# Altium schematic sheet secondary_DIO.SchDoc: foxBMS BMS-Slave 12-Cell
size A3; DocumentNumber: 19; SheetNumber: 19; SheetTotal: 21; AUTHOR: Fraunhofer IISB foxBMS Team; SheetDescription: Secondary Digital Inputs/Outputs
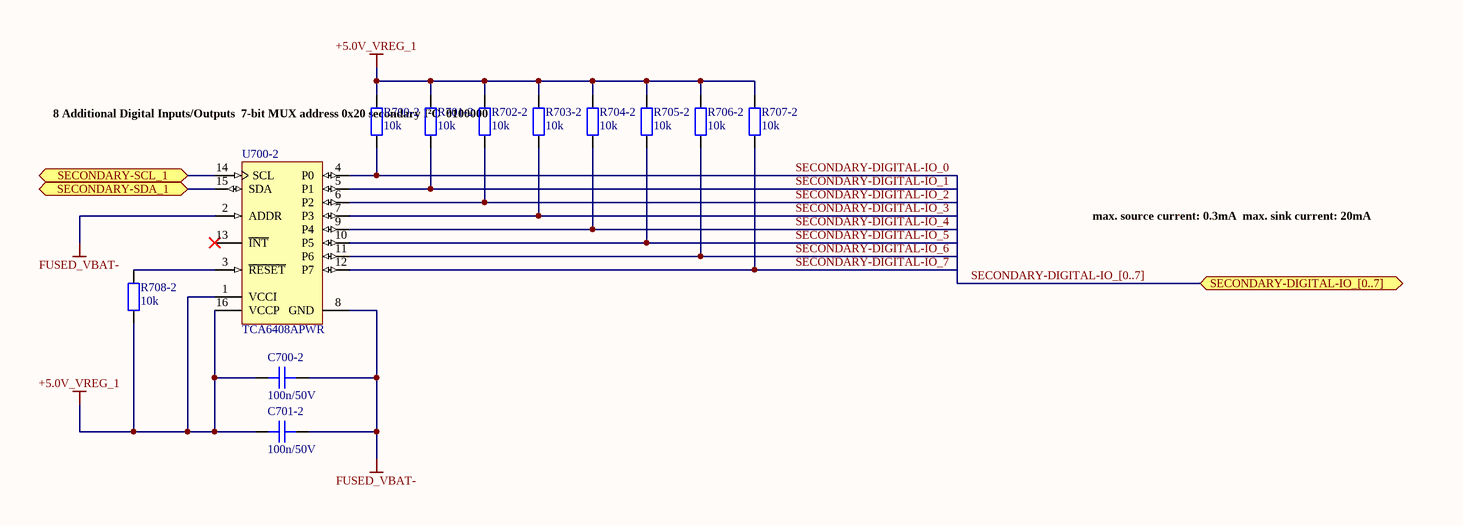
[diagram p0: secondary_DIO.SchDoc]

## Parts
C700-2  100n/50V  [CAPC1608X08N]
C701-2  100n/50V  [CAPC1608X08N]
R700-2  10k  [RESC1608X05N]
R701-2  10k  [RESC1608X05N]
R702-2  10k  [RESC1608X05N]
R703-2  10k  [RESC1608X05N]
R704-2  10k  [RESC1608X05N]
R705-2  10k  [RESC1608X05N]
R706-2  10k  [RESC1608X05N]
R707-2  10k  [RESC1608X05N]
R708-2  10k  [RESC1608X05N]
U700-2  TCA6408APWR  [PW0016A_L]

## Ports
SECONDARY-DIGITAL-IO_[0..7] (bidir), SECONDARY-SCL_1 (bidir), SECONDARY-SDA_1 (bidir)

## Nets
+5.0V_VREG_1: C700-2.2 C701-2.2 R700-2.2 R701-2.2 R702-2.2 R703-2.2 R704-2.2 R705-2.2 R706-2.2 R707-2.2 R708-2.1 U700-2.1(VCCI) U700-2.16(VCCP)
FUSED_VBAT-: C700-2.1 C701-2.1 U700-2.2(ADDR) U700-2.8(GND)
SECONDARY-DIGITAL-IO_0: R700-2.1 U700-2.4(P0)
SECONDARY-DIGITAL-IO_1: R701-2.1 U700-2.5(P1)
SECONDARY-DIGITAL-IO_2: R702-2.1 U700-2.6(P2)
SECONDARY-DIGITAL-IO_3: R703-2.1 U700-2.7(P3)
SECONDARY-DIGITAL-IO_4: R704-2.1 U700-2.9(P4)
SECONDARY-DIGITAL-IO_5: R705-2.1 U700-2.10(P5)
SECONDARY-DIGITAL-IO_6: R706-2.1 U700-2.11(P6)
SECONDARY-DIGITAL-IO_7: R707-2.1 U700-2.12(P7)
SECONDARY-SCL_1: U700-2.14(SCL) ; port SECONDARY-SCL_1
SECONDARY-SDA_1: U700-2.15(SDA) ; port SECONDARY-SDA_1
NetR708-2_2: R708-2.2 U700-2.3(~{RESET})

Not connected (* = marked no-connect by the designer): U700-2 13(~{INT})*

## Buses and harness runs
bus SECONDARY-DIGITAL-IO_[0..7] = port SECONDARY-DIGITAL-IO_[0..7]

## Notes on the sheet
- 8 Additional Digital Inputs/Outputs
  7-bit MUX address 0x20 secondary I²C
  0100000
- max. source current: 0.3mA
  max. sink current: 20mA
- Fraunhofer IISB
- Schottkystr. 10
- developed by:
- 91058 Erlangen
- Germany
- Author
- Project
- License
- Description
- File
- Version
- Release Date
- Sheet
- www.foxbms.org
- www.iisb.fraunhofer.de
- foxBMS Team
- /

## Library data of the parts
C700-2 C701-2 = gen_C_ceramic_100n_50V_X7R_0603: MLCC; Capacitance: 100n; Rated Voltage: 50V; Dielectric: X7R; Case EIA: 0603; Case Metric: 1608; PnP Package: C_0603_10; PnP Value: 100n/50V/X7R; PnP equipped: x; Automotive Qualified: True; Part Number: gen_C_ceramic_100n_50V_X7R_0603; Supplier 1: Farnell; Supplier Part Number 1: 2525267; Supplier 2: Digikey; Supplier Part Number 2: 490-6049-1-ND; Supplier 3: Farnell; Supplier Part Number 3: 2070398
R700-2 R701-2 R702-2 R703-2 R704-2 R705-2 R706-2 R707-2 = gen_R_10k_0603: SMD Resistor 10k 0603; Tolerance: 1%; Power: 0.1W; Case EIA: 0603; Case Metric: 1608; Maximum Working Voltage: 75V; PnP Package: R_0603; Automotive Qualified: False; Part Number: gen_R_10k_0603; Operating Temperature: -55°C - +155°C; Resistance: 10k; Series: E24, E96; PnP Value: 10k; Supplier 1: Farnell; Supplier Part Number 1: 2073349
R708-2 = gen_R_10k_0603: SMD Resistor 10k 0603; Tolerance: 1%; Power: 0.1W; Case EIA: 0603; Case Metric: 1608; Maximum Working Voltage: 75V; PnP Package: R_0603; Automotive Qualified: True; Part Number: gen_R_10k_0603; Operating Temperature: -55°C - +155°C; Resistance: 10k; Series: E24, E96; PnP Value: 10k; Supplier 1: Farnell; Supplier Part Number 1: 2073349
U700-2 = CMP-0314-00338-2: Low-Voltage 8-Bit I2C and SMBus I/O Expander, 1.65 to 5.5 V, -40 to 85 degC, 16-pin TSSOP (PW), Green (RoHS & no Sb/Br); Manufacturer: Texas Instruments; Push-Pull I/O Type: Yes; Max Frequency(kHz): 400; No. of Outputs: 8; VCC(Min)(V): 1.65; SubFamily: I2C IO Expander; I2C Address: 0100 00x; VCC(Max)(V): 5.5; Vcc range(V): 1.65 to 5.5; PackageDescription: 16-Pin Plastic Thin Small Outline Package 5 x 4.4 mm Body ,0.65 mm Pitch; PartNumber: TCA6408APWR; Configuration Registers: Yes; Eco-Plan: Green (RoHS & no Sb/Br); ComponentLink1Description: Datasheet; Low Power: Yes; ComponentLink1URL: http://www.ti.com/general/docs/lit/getliterature.tsp?genericPartNumber=TCA6408A&fileType=pdf; 5V Tolerant I/O: Yes; Code_JEDEC: MO-153; Interrupt Output: Yes; PackageVersion: revG, Feb-2011; # of I/Os: 8; Reset Input: Yes; fSCLK(Max)(MHz): 400; PackageReference: PW0016A; Mounting Technology: Surface Mount; DatasheetVersion: SCPS192C